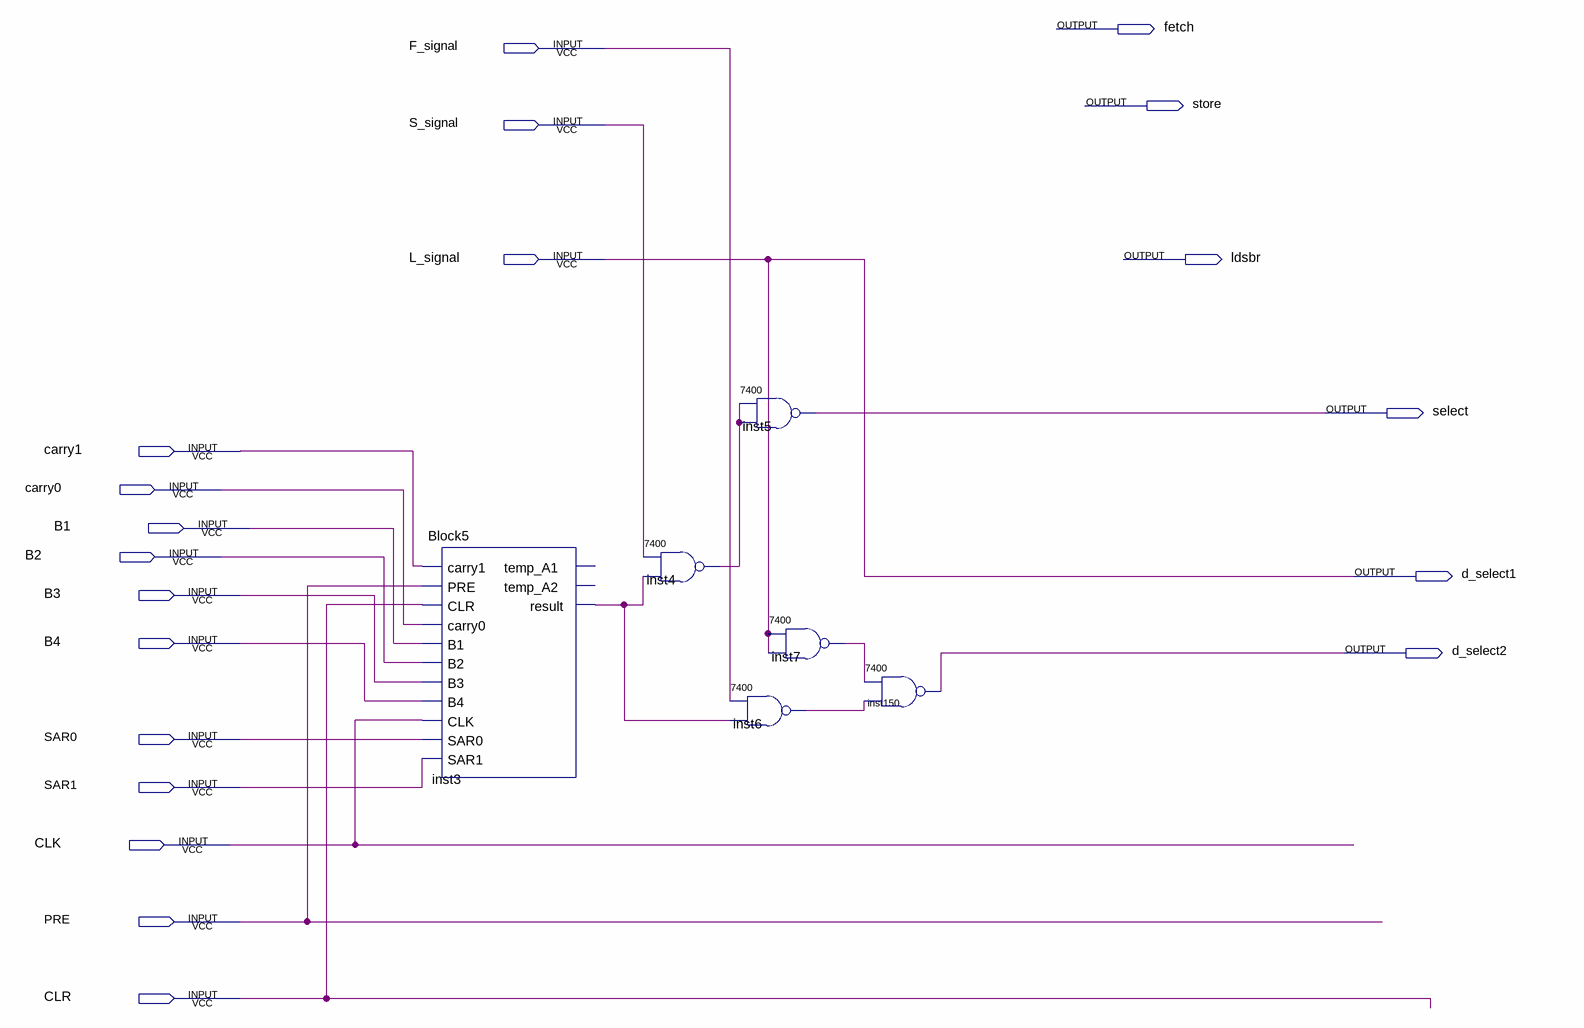
[diagram p0: schematic sheet]
// Quartus schematic lab2.bdf as structural Verilog: 6 symbols, 20 pins
module lab2 (
  input  F_signal,
  input  S_signal,
  input  L_signal,
  input  carry1,
  input  carry0,
  input  B1,
  input  B2,
  input  B3,
  input  B4,
  input  SAR0,
  input  SAR1,
  input  CLK,
  input  PRE,
  input  CLR,
  output fetch,
  output store,
  output ldsbr,
  output select,
  output d_select1,
  output d_select2
);

  wire inst3_result, inst4_1, inst6_1, inst7_1;

  Block5 inst3 (
    .carry1(carry1), .PRE(PRE), .CLR(CLR), .carry0(carry0), .B1(B1), .B2(B2), .B3(B3), .B4(B4), .CLK(CLK),
    .SAR0(SAR0), .SAR1(SAR1), .result(inst3_result));  // open: temp_A1, temp_A2
  \7400  inst4 (.\3 (inst3_result), .\2 (S_signal), .\1 (inst4_1));
  \7400  inst6 (.\3 (inst3_result), .\2 (F_signal), .\1 (inst6_1));
  \7400  inst5 (.\3 (inst4_1), .\2 (inst4_1), .\1 (select));
  \7400  inst7 (.\3 (L_signal), .\2 (L_signal), .\1 (inst7_1));
  \7400  inst150 (.\3 (inst6_1), .\2 (inst7_1), .\1 (d_select2));

  assign d_select1 = L_signal;
endmodule
